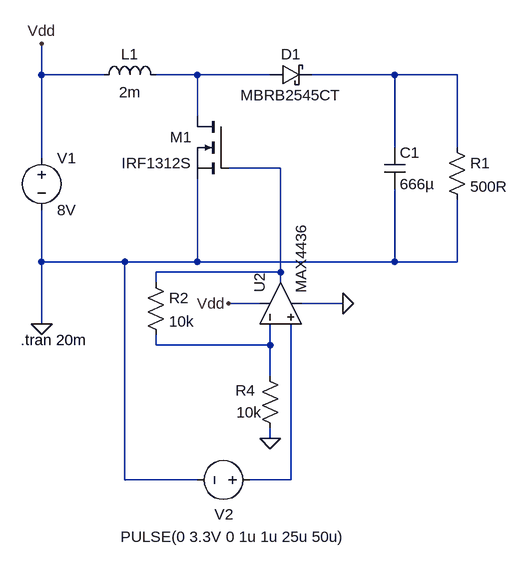
[diagram p0: schematic boost.asc]
boost.asc, the LTspice schematic file:
Version 4
SHEET 1 996 680
WIRE -176 -48 -176 -96
WIRE -80 -48 -176 -48
WIRE 64 -48 0 -48
WIRE 176 -48 64 -48
WIRE 368 -48 240 -48
WIRE 464 -48 368 -48
WIRE 64 16 64 -48
WIRE 368 64 368 -48
WIRE 464 64 464 -48
WIRE -176 80 -176 -48
WIRE 192 96 112 96
WIRE -176 240 -176 160
WIRE -48 240 -176 240
WIRE 64 240 64 112
WIRE 64 240 -48 240
WIRE 368 240 368 128
WIRE 368 240 64 240
WIRE 464 240 464 144
WIRE 464 240 368 240
WIRE 192 256 192 96
WIRE 192 256 0 256
WIRE 0 272 0 256
WIRE 192 272 192 256
WIRE 160 304 112 304
WIRE 288 304 224 304
WIRE -176 336 -176 240
WIRE 0 368 0 352
WIRE 176 368 176 336
WIRE 176 368 0 368
WIRE 176 416 176 368
WIRE 176 512 176 496
WIRE -48 576 -48 240
WIRE 64 576 -48 576
WIRE 208 576 208 336
WIRE 208 576 144 576
FLAG -176 336 0
FLAG -176 -96 Vdd
FLAG 112 304 Vdd
FLAG 176 512 0
FLAG 288 304 0
SYMBOL res 448 48 R0
SYMATTR InstName R1
SYMATTR Value 500R
SYMBOL cap 352 64 R0
SYMATTR InstName C1
SYMATTR Value 666µ
SYMATTR SpiceLine V=75 Irms=4.14 Rser=0.035 Lser=0
SYMBOL ind -96 -32 R270
WINDOW 0 32 56 VTop 2
WINDOW 3 5 56 VBottom 2
SYMATTR InstName L1
SYMATTR Value 2m
SYMATTR SpiceLine Ipk=0.41 Rser=1.5456 Rpar=188400 Cpar=0 mfg="Coilcraft" pn="SPT50L-205"
SYMBOL schottky 176 -32 R270
WINDOW 0 32 32 VTop 2
WINDOW 3 0 32 VBottom 2
SYMATTR InstName D1
SYMATTR Value MBRB2545CT
SYMATTR Description Diode
SYMATTR Type diode
SYMBOL voltage -176 64 R0
WINDOW 123 0 0 Left 0
WINDOW 39 0 0 Left 0
SYMATTR InstName V1
SYMATTR Value 8V
SYMBOL nmos 112 16 M0
SYMATTR InstName M1
SYMATTR Value IRF1312S
SYMBOL voltage 160 576 R90
WINDOW 3 87 -132 VRight 2
WINDOW 123 0 0 Left 0
WINDOW 39 0 0 Left 0
WINDOW 0 53 70 VLeft 2
SYMATTR Value PULSE(0 3.3V 0 1u 1u 25u 50u)
SYMATTR InstName V2
SYMBOL res 160 400 R0
WINDOW 0 -37 38 Left 2
WINDOW 3 -36 72 Left 2
SYMATTR InstName R4
SYMATTR Value 10k
SYMBOL res -16 256 R0
SYMATTR InstName R2
SYMATTR Value 10k
SYMBOL OpAmps\\MAX4436 128 304 R270
SYMATTR InstName U2
TEXT -208 360 Left 2 !.tran 20m

The netlist it stands for:
* boost.asc
R1 N002 0 500R
C1 N002 0 666µ V=75 Irms=4.14 Rser=0.035 Lser=0
L1 Vdd N001 2m Ipk=0.41 Rser=1.5456 Rpar=188400 Cpar=0 mfg="Coilcraft" pn="SPT50L-205"
D1 N001 N002 MBRB2545CT
V1 Vdd 0 8V
M1 N001 N003 0 0 IRF1312S
V2 N005 0 PULSE(0 3.3V 0 1u 1u 25u 50u)
R4 N004 0 10k
R2 N003 N004 10k
XU2 N005 N004 Vdd 0 N003 MAX4436  ; pins In+ In- V+ V- OUT
.model D D
.lib standard.dio
.model NMOS NMOS
.model PMOS PMOS
.lib standard.mos
.tran 20m
.backanno
.end